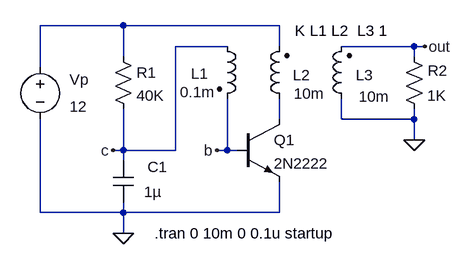
[diagram p0: schematic BlockGen.asc]
BlockGen.asc, the LTspice schematic file:
Version 4
SHEET 1 880 680
WIRE 0 -32 -128 -32
WIRE 240 -32 0 -32
WIRE 160 0 80 0
WIRE 240 0 240 -32
WIRE 448 0 336 0
WIRE 464 0 448 0
WIRE 0 16 0 -32
WIRE 448 16 448 0
WIRE -128 32 -128 -32
WIRE 240 112 240 80
WIRE 336 112 336 80
WIRE 448 112 448 96
WIRE 448 112 336 112
WIRE 448 144 448 112
WIRE 0 160 0 96
WIRE 0 160 -16 160
WIRE 80 160 80 0
WIRE 80 160 0 160
WIRE 160 160 160 80
WIRE 160 160 144 160
WIRE 176 160 160 160
WIRE 0 176 0 160
WIRE -128 256 -128 112
WIRE 0 256 0 240
WIRE 0 256 -128 256
WIRE 240 256 240 208
WIRE 240 256 0 256
WIRE 0 288 0 256
FLAG 0 288 0
FLAG -16 160 c
FLAG 144 160 b
FLAG 464 0 out
FLAG 448 144 0
SYMBOL npn 176 112 R0
SYMATTR InstName Q1
SYMATTR Value 2N2222
SYMBOL ind2 144 -16 R0
WINDOW 0 -40 58 Left 0
WINDOW 3 -57 86 Left 0
SYMATTR InstName L1
SYMATTR Value 0.1m
SYMATTR Type ind
SYMBOL ind2 256 96 R180
WINDOW 0 -32 52 Left 0
WINDOW 3 -54 23 Left 0
SYMATTR InstName L2
SYMATTR Value 10m
SYMATTR Type ind
SYMBOL voltage -128 16 R0
WINDOW 123 0 0 Left 0
WINDOW 39 24 132 Left 0
WINDOW 0 45 35 Left 0
WINDOW 3 45 77 Left 0
SYMATTR InstName Vp
SYMATTR Value 12
SYMBOL res -16 0 R0
SYMATTR InstName R1
SYMATTR Value 40K
SYMBOL cap -16 176 R0
WINDOW 0 53 10 Left 0
WINDOW 3 48 48 Left 0
SYMATTR InstName C1
SYMATTR Value 1µ
SYMBOL res 432 0 R0
WINDOW 0 37 37 Left 0
SYMATTR InstName R2
SYMATTR Value 1K
SYMBOL ind2 352 96 R180
WINDOW 0 -33 52 Left 0
WINDOW 3 -58 19 Left 0
SYMATTR InstName L3
SYMATTR Value 10m
SYMATTR Type ind
TEXT 264 -24 Left 0 !K L1 L2  L3 1
TEXT 48 288 Left 0 !.tran 0 10m 0 0.1u startup

The netlist it stands for:
* BlockGen.asc
Q1 N002 b 0 0 2N2222
L1 c b 0.1m
L2 N002 N001 10m
Vp N001 0 12
R1 N001 c 40K
C1 c 0 1µ
R2 out 0 1K
L3 0 out 10m
.model NPN NPN
.model PNP PNP
.lib standard.bjt
K L1 L2  L3 1
.tran 0 10m 0 0.1u startup
.backanno
.end